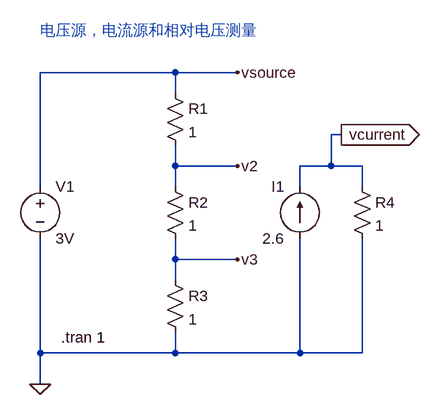
[diagram p0: schematic 02_VSourceAndISource.asc]
02_VSourceAndISource.asc, the LTspice schematic file:
Version 4
SHEET 1 880 680
WIRE 352 64 144 64
WIRE 448 64 352 64
WIRE 352 96 352 64
WIRE 608 160 592 160
WIRE 352 208 352 176
WIRE 448 208 352 208
WIRE 592 208 592 160
WIRE 592 208 544 208
WIRE 640 208 592 208
WIRE 144 240 144 64
WIRE 352 240 352 208
WIRE 544 240 544 208
WIRE 640 240 640 208
WIRE 352 352 352 320
WIRE 448 352 352 352
WIRE 352 384 352 352
WIRE 144 496 144 320
WIRE 352 496 352 464
WIRE 352 496 144 496
WIRE 544 496 544 320
WIRE 544 496 352 496
WIRE 640 496 640 320
WIRE 640 496 544 496
WIRE 144 544 144 496
FLAG 448 64 vsource
FLAG 448 208 v2
FLAG 448 352 v3
FLAG 144 544 0
FLAG 608 160 vcurrent
IOPIN 608 160 Out
SYMBOL Voltage 144 224 R0
SYMATTR InstName V1
SYMATTR Value 3V
SYMBOL Res 336 80 R0
SYMATTR InstName R1
SYMATTR Value 1
SYMBOL Res 336 224 R0
SYMATTR InstName R2
SYMATTR Value 1
SYMBOL Res 336 368 R0
SYMATTR InstName R3
SYMATTR Value 1
SYMBOL current 544 320 R180
WINDOW 0 24 80 Left 2
WINDOW 3 24 0 Left 2
SYMATTR InstName I1
SYMATTR Value 2.6
SYMBOL Res 624 224 R0
SYMATTR InstName R4
SYMATTR Value 1
TEXT 176 472 Left 2 !.tran 1
TEXT 144 0 Left 2 ;电压源，电流源和相对电压测量

The netlist it stands for:
* 02_VSourceAndISource.asc
V1 vsource 0 3V
R1 vsource v2 1
R2 v2 v3 1
R3 v3 0 1
I1 0 vcurrent 2.6
R4 vcurrent 0 1
.tran 1
* 电压源，电流源和相对电压测量
.backanno
.end